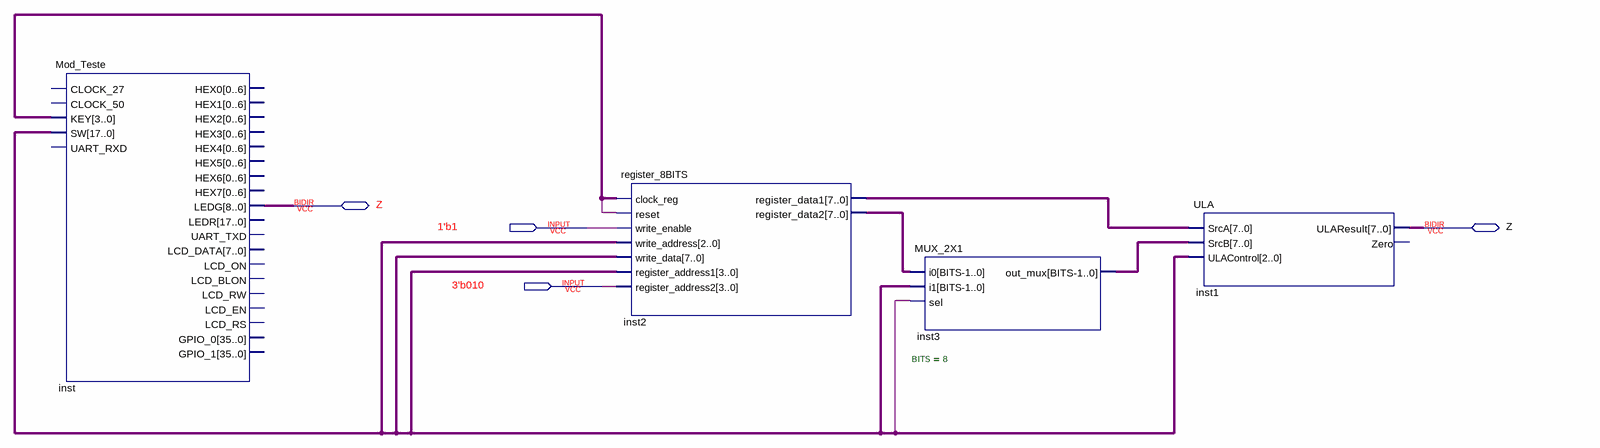
[diagram p0: schematic sheet]
// Quartus schematic Mod_Teste_ex.bdf as structural Verilog: 4 symbols, 4 pins
module Mod_Teste_ex (
  input  \1'b1 ,
  input  \3'b010 ,
  inout  Z
);

  wire undriven_2, undriven_3;
  wire [3:0] undriven;
  wire [7:0] inst1_ularesult, inst2_register_data1, inst2_register_data2, inst3_out_mux;
  wire [8:0] inst_ledg;
  wire [17:0] undriven_4;

  Mod_Teste inst (
    .KEY(undriven), .SW(undriven_4), .LEDG(inst_ledg));  // open: CLOCK_27, CLOCK_50, UART_RXD, HEX0, HEX1, HEX2, HEX3, HEX4, HEX5, HEX6, HEX7, LEDR, UART_TXD, LCD_ON, LCD_BLON, LCD_RW, LCD_EN, LCD_RS, LCD_DATA, GPIO_0, GPIO_1
  register_8BITS inst2 (
    .clock_reg(undriven), .reset(undriven_2), .write_enable(\1'b1 ), .write_address(undriven_4),
    .write_data(undriven_4), .register_address1(undriven_4), .register_address2({4{\3'b010 }}),
    .register_data1(inst2_register_data1), .register_data2(inst2_register_data2));
  MUX_2X1 #(.BITS(8)) inst3 (.i0(inst2_register_data2), .i1(undriven_4), .sel(undriven_3), .out_mux(inst3_out_mux));
  ULA inst1 (
    .SrcA(inst2_register_data1), .SrcB(inst3_out_mux), .ULAControl(undriven_4), .ULAResult(inst1_ularesult));  // open: Zero
endmodule
